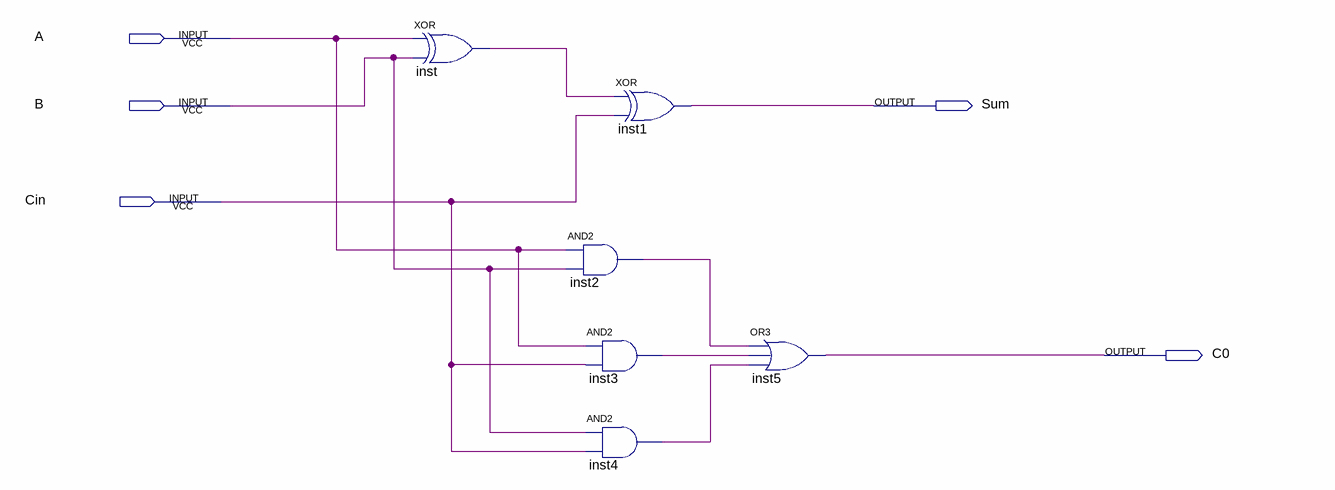
[diagram p0: schematic sheet]
// Quartus schematic Assignment1.bdf as structural Verilog: 6 symbols, 5 pins
module Assignment1 (
  input  A,
  input  B,
  input  Cin,
  output Sum,
  output C0
);

  wire inst2_out, inst3_out, inst4_out, inst_out;

  xor inst (inst_out, A, B);
  xor inst1 (Sum, inst_out, Cin);
  and inst2 (inst2_out, A, B);
  and inst3 (inst3_out, A, Cin);
  and inst4 (inst4_out, B, Cin);
  or inst5 (C0, inst2_out, inst3_out, inst4_out);
endmodule
